# EAGLE design ECNG3020 Schematic (EAGLE 9.5.1)
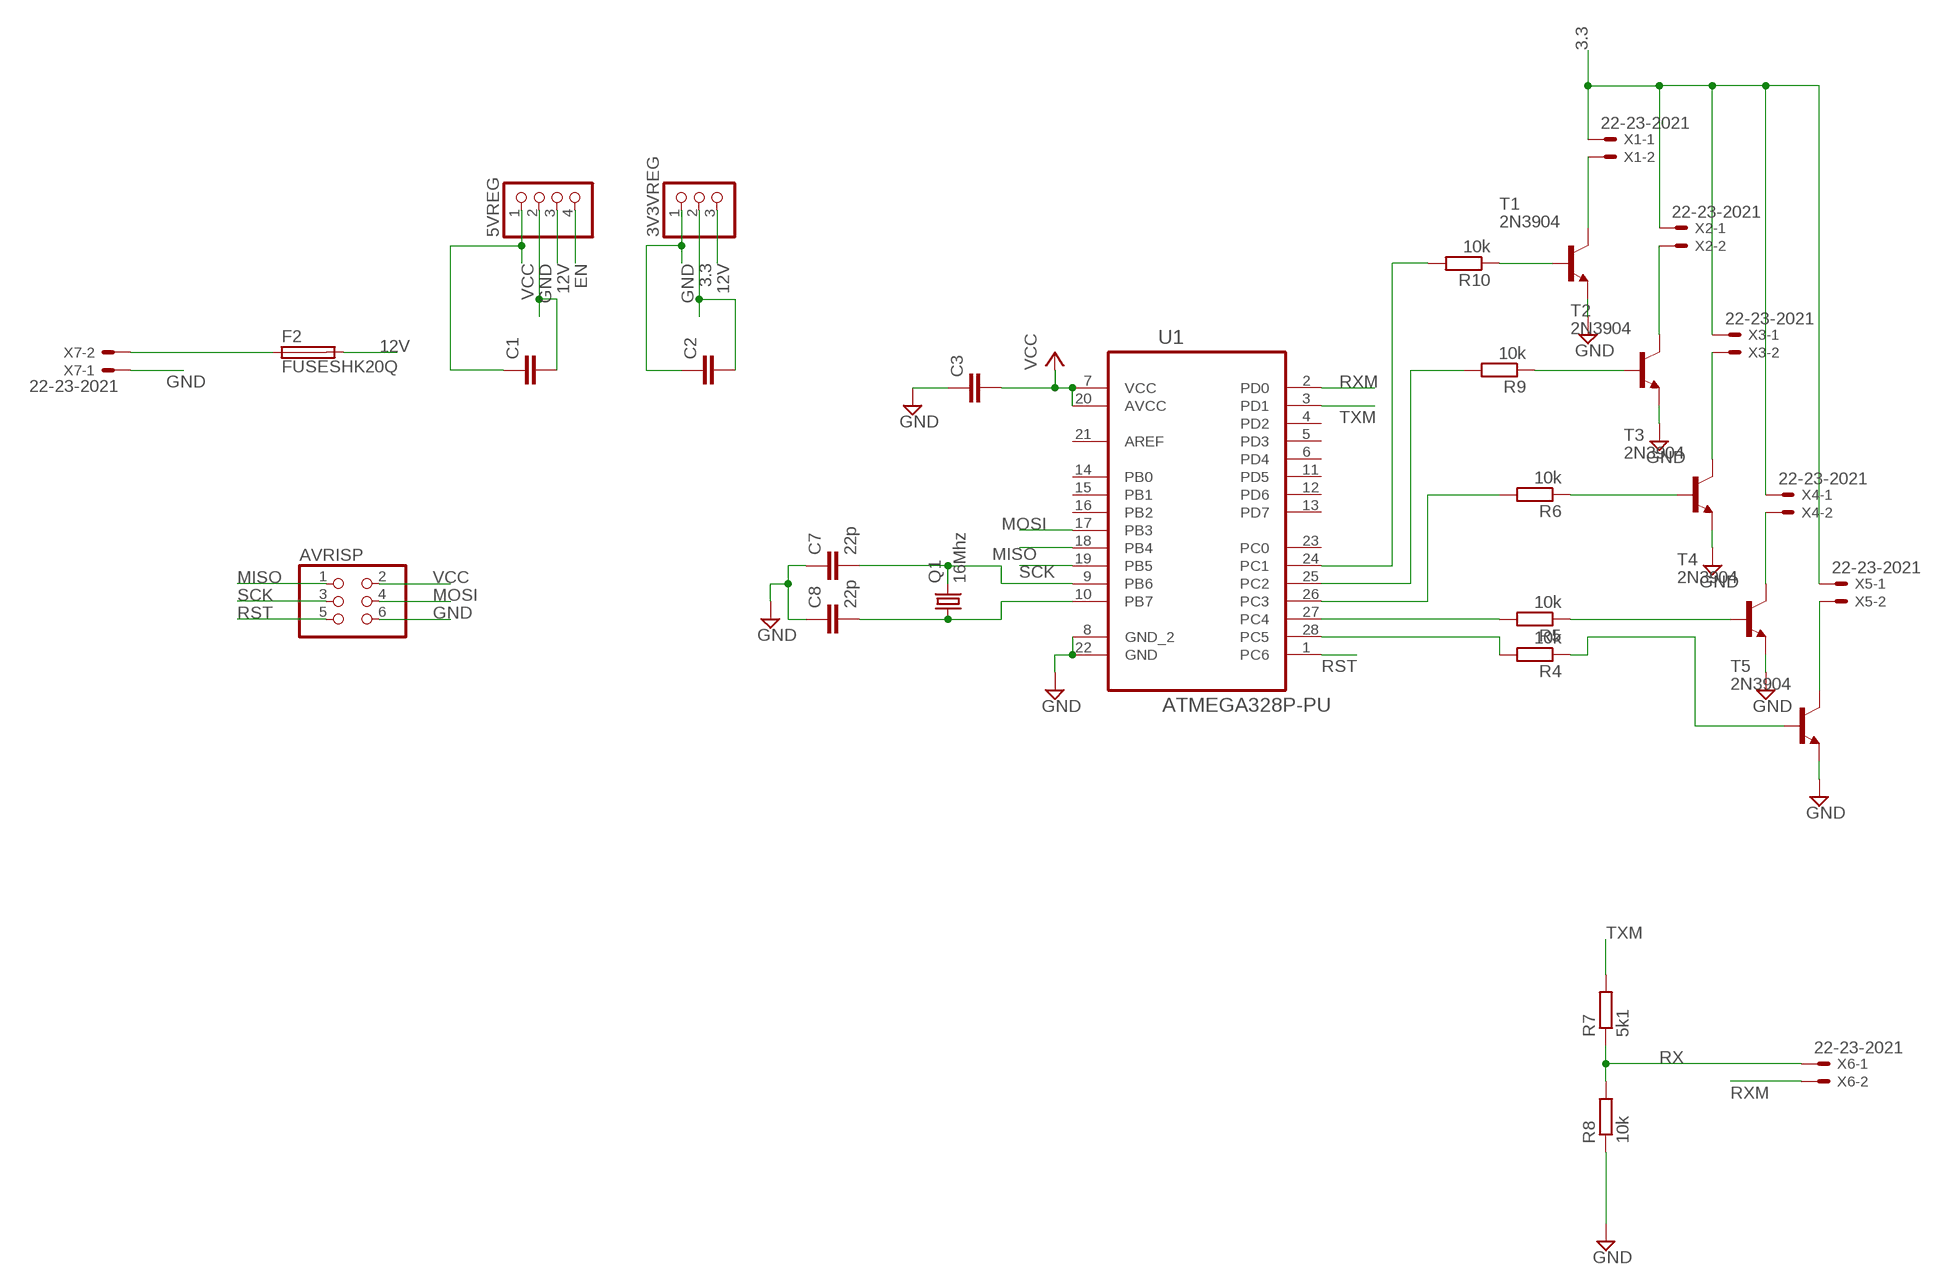
[diagram p0: schematic, sheet 1]

## Parts
3V3VREG  PINHD-1X3M  [1X03M]
5VREG  PINHD-1X4M  [1X04M]
AVRISP  PINHD-2X3  [2X03]
C1  C2,5-3  [C2.5-3]
C2  C2,5-3  [C2.5-3]
C3  C2,5-3  [C2.5-3]
C7  22p  C-EU050-024X044  [C050-024X044]
C8  22p  C-EU050-024X044  [C050-024X044]
F2  FUSESHK20Q  [SHK20Q]
Q1  16Mhz  CRYSTALHC49S  [HC49/S]
R4  10k  R-EU_0207/10  [0207/10]
R5  10k  R-EU_0207/10  [0207/10]
R6  10k  R-EU_0207/10  [0207/10]
R7  5k1  R-EU_0207/10  [0207/10]
R8  10k  R-EU_0207/10  [0207/10]
R9  10k  R-EU_0207/10  [0207/10]
R10  10k  R-EU_0207/10  [0207/10]
T1  2N3904  [TO92]
T2  2N3904  [TO92]
T3  2N3904  [TO92]
T4  2N3904  [TO92]
T5  2N3904  [TO92]
U1  ATMEGA328P-PU  [DIP254P762X457-28]
X1  22-23-2021  [22-23-2021]
X2  22-23-2021  [22-23-2021]
X3  22-23-2021  [22-23-2021]
X4  22-23-2021  [22-23-2021]
X5  22-23-2021  [22-23-2021]
X6  22-23-2021  [22-23-2021]
X7  22-23-2021  [22-23-2021]

## Nets
3.3: 3V3VREG.2 C2.2 X1.1 X2.1 X3.1 X4.1 X5.1
12V: 3V3VREG.3 5VREG.3 F2.2A
EN: 5VREG.4
GND: 3V3VREG.1 5VREG.2 AVRISP.6 C1.2 C2.1 C3.1 C7.1 C8.1 R8.1 T1.3(E) T2.3(E) T3.3(E) T4.3(E) T5.3(E) U1.8(GND_2) U1.22(GND) X7.1
MISO: AVRISP.1 U1.18(PB4)
MOSI: AVRISP.4 U1.17(PB3)
N$1: R10.2 U1.24(PC1)
N$2: R9.2 U1.25(PC2)
N$3: C7.2 Q1.2 U1.9(PB6)
N$4: R6.2 U1.26(PC3)
N$5: C8.2 Q1.1 U1.10(PB7)
N$6: R10.1 T1.2(B)
N$7: R4.1 T5.2(B)
N$8: T5.1(C) X5.2
N$9: T4.1(C) X4.2
N$10: T3.1(C) X3.2
N$11: T2.1(C) X2.2
N$12: T1.1(C) X1.2
N$13: F2.1A X7.2
N$14: R9.1 T2.2(B)
N$15: R6.1 T3.2(B)
N$16: R5.1 T4.2(B)
N$17: R5.2 U1.27(PC4)
N$18: R4.2 U1.28(PC5)
RST: AVRISP.5 U1.1(PC6)
RX: R7.1 R8.2 X6.1
RXM: U1.2(PD0) X6.2
SCK: AVRISP.3 U1.19(PB5)
TXM: R7.2 U1.3(PD1)
VCC: 5VREG.1 AVRISP.2 C1.1 C3.2 U1.7(VCC) U1.20(AVCC)
Unconnected: U1.4(PD2) U1.5(PD3) U1.6(PD4) U1.11(PD5) U1.12(PD6) U1.13(PD7) U1.14(PB0) U1.15(PB1) U1.16(PB2) U1.21(AREF) U1.23(PC0)

## Library data of the parts
3V3VREG = pinhead_2:PINHD-1X3: PIN HEADER
5VREG = pinhead_2:PINHD-1X4: PIN HEADER
AVRISP = pinhead_2:PINHD-2X3: PIN HEADER
C1-C3 = capacitor-wima:C: CAPACITOR naming: grid - package width
C7 C8 = rcl:C-EU: CAPACITOR, European symbol; SPICEPREFIX: C
F2 = fuse:FUSE: Fuse; OC_FARNELL: unknown; OC_NEWARK: unknown
Q1 = crystal:CRYSTAL: CRYSTAL; OC_FARNELL: 1667008; OC_NEWARK: unknown
R4-R10 = rcl:R-EU_: RESISTOR, European symbol; SPICEPREFIX: R
T1-T5 = transistor-neu-to92:2N3904: NPN TRANSISTOR
U1 = ATMEGA328P-PU:ATMEGA328P-PU: 8-bit Microcontroller with In-System Programmable Flash Buy Part <https://snapeda.com/parts/ATMEGA328P-PU/Microchip/view-part/?ref=eda>; AVAILABILITY: Good; DESCRIPTION: AVR AVR® ATmega Microcontroller IC 8-Bit 20MHz 32KB (16K x 16) FLASH 28-PDIP; DIGIKEY-PURCHASE-URL: https://snapeda.com/shop?store=DigiKey&id=2895131; MF: Microchip; MOUSER-PURCHASE-URL: https://snapeda.com/shop?store=Mouser&id=2895131; MP: ATMEGA328P-PU; PACKAGE: DIP-28 Generic; PRICE: None
X1-X7 = con-molex:22-23-2021: .100" (2.54mm) Center Header - 2 Pin; MF: MOLEX; MPN: 22-23-2021; OC_FARNELL: 1462926; OC_NEWARK: 25C3832

## Board
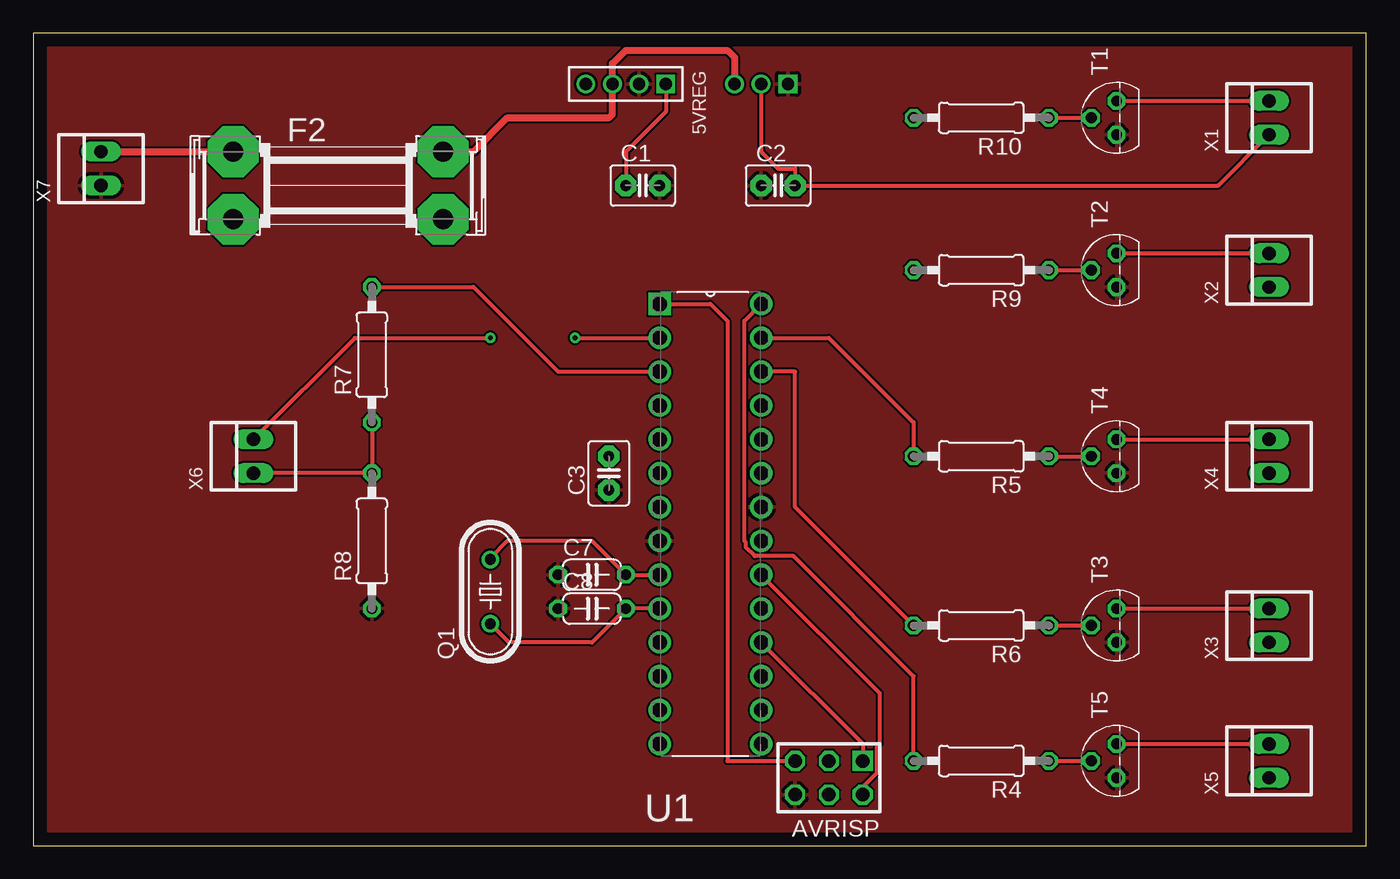
[diagram p1: board, top side]
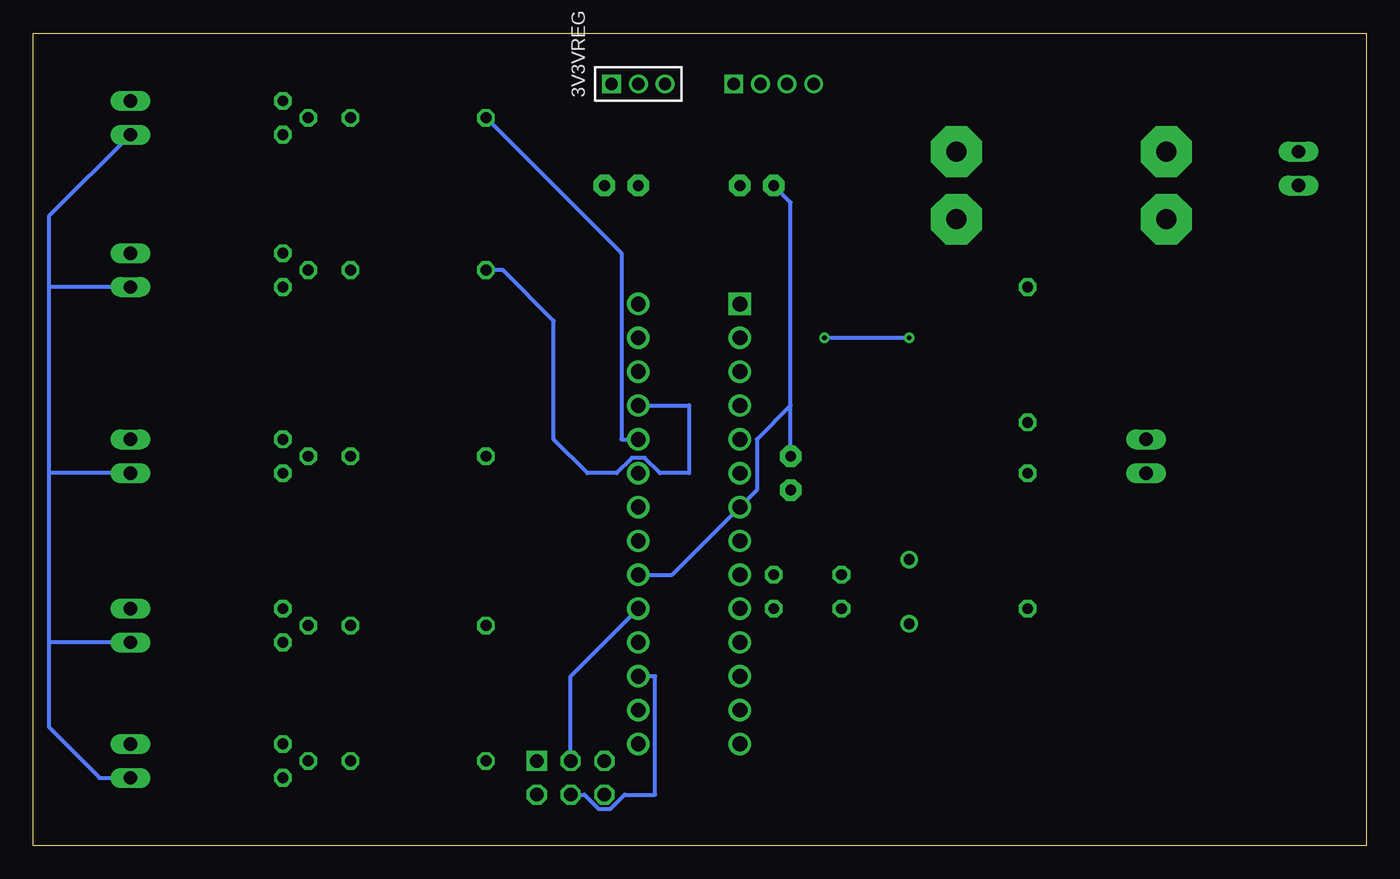
[diagram p2: board, bottom side, seen from below]

Size 100 x 60.95 mm. Coordinates in mm from the lower left corner, seen from the top.
Outline: 0,0 100,0 100,60.95 0,60.95 0,0
Copper layers (1*16): Top 0.035mm / dielectric 1.5mm / Bottom 0.035mm
Design rules "default": minimum track width 6mil, minimum drill 0.35mm, track to track 6mil, track to pad 6mil, pad to pad 6mil, via to via 6mil, smd to smd 6mil, copper to edge 40mil, drill to drill 6mil, minimum pad ring 10mil, minimum via ring 8mil, stop-mask expansion 4mil, vias tented up to drill 0mil, thermal gap 10mil

### Footprints (pad centres in the part's own frame; a part is rotated, then mirrored left to right if it is on the bottom)
1X03M = drill 0.914 square: 1 -2,0 | drill 0.914: 2 0,0; 3 2,0
1X04M = drill 0.914 square: 1 -3,0 | drill 0.914: 2 -1,0; 3 1,0; 4 3,0
2X03 = drill 1.016 square: 1 -2.54,-1.27 | drill 1.016 octagon: 2 -2.54,1.27; 3 0,-1.27; 4 0,1.27; 5 2.54,-1.27; 6 2.54,1.27
C2.5-3 = drill 0.813 pad 1.6 octagon: 1 -1.27,0; 2 1.27,0
C050-024X044 = drill 0.813 octagon: 1 -2.54,0; 2 2.54,0
SHK20Q = drill 1.5 pad 3.81 octagon: 1A -7.874,2.54; 1B -7.874,-2.54; 2A 7.874,2.54; 2B 7.874,-2.54
HC49/S = drill 0.813: 1 -2.413,0; 2 2.413,0
0207/10 = drill 0.813 octagon: 1 -5.08,0; 2 5.08,0
TO92 = drill 0.813 octagon: 1 1.27,0; 2 0,1.905; 3 -1.27,0
DIP254P762X457-28 = drill 1.118 square: 1 -7.62,33.02 | drill 1.118: 2 -7.62,30.48; 3 -7.62,27.94; 4 -7.62,25.4; 5 -7.62,22.86; 6 -7.62,20.32; 7 -7.62,17.78; 8 -7.62,15.24; 9 -7.62,12.7; 10 -7.62,10.16; 11 -7.62,7.62; 12 -7.62,5.08; 13 -7.62,2.54; 14 -7.62,0; 15 0,0; 16 0,2.54; 17 0,5.08; 18 0,7.62; 19 0,10.16; 20 0,12.7; 21 0,15.24; 22 0,17.78; 23 0,20.32; 24 0,22.86; 25 0,25.4; 26 0,27.94; 27 0,30.48; 28 0,33.02
22-23-2021 = drill 1 long: 1 -1.27,0; 2 1.27,0

### Placement (x,y rotation side)
3V3VREG  54.61,57.15 0 bottom
5VREG  44.45,57.15 180 top
AVRISP  59.69,5.08 180 top
C1  45.72,49.53 0 top
C2  55.88,49.53 0 top
C3  43.18,27.94 90 top
C7  41.91,20.32 0 top
C8  41.91,17.78 0 top
F2  22.86,49.53 0 top
Q1  34.29,19.05 90 top
R4  71.12,6.35 180 top
R5  71.12,29.21 180 top
R6  71.12,16.51 180 top
R7  25.4,36.83 90 top
R8  25.4,22.86 90 top
R9  71.12,43.18 180 top
R10  71.12,54.61 180 top
T1  81.28,54.61 90 top
T2  81.28,43.18 90 top
T3  81.28,16.51 90 top
T4  81.28,29.21 90 top
T5  81.28,6.35 90 top
U1  54.61,7.62 0 top
X1  92.71,54.61 90 top
X2  92.71,43.18 90 top
X3  92.71,16.51 90 top
X4  92.71,29.21 90 top
X5  92.71,6.35 90 top
X6  16.51,29.21 90 top
X7  5.08,50.8 90 top

### Tracks (layer width: path | path; a pad name or v marks a point on that pad's centre or on a via)
3.3
  Top 0.305: 3V3VREG.2 54.61,52.07 55.88,50.8 57.15,50.8 C2.2 88.9,49.53 X1.1
  Bottom 0.305: 98.83,41.91 98.83,47.22 X1.1 | 98.83,41.91 98.83,27.94 | 98.83,27.94 98.83,15.24 | 98.83,15.24 98.83,8.89 95.02,5.08 X5.1 | X3.1 98.83,15.24 | X4.1 98.83,27.94 | X2.1 98.83,41.91
12V
  Top 0.508: F2.2A 33.02,52.07 35.56,54.61 43.18,54.61 43.45,54.88 5VREG.3 43.45,58.68 44.45,59.68 52.07,59.68 52.61,59.14 3V3VREG.3
GND
  pour Top: 0,0 100.33,0 100.33,60.96 0,60.96
MISO
  Top 0.305: U1.18 62.23,7.62 AVRISP.1
MOSI
  Bottom 0.305: AVRISP.4 58.66,3.81 57.59,2.74 56.71,2.74 55.64,3.81 53.34,3.81 53.34,12.7 U1.17
N$1
  Bottom 0.305: R10.2 55.88,44.45 55.88,30.48 U1.24
N$2
  Bottom 0.305: U1.25 50.8,33.02 50.8,27.94 52.99,27.94 54.14,29.08 55.08,29.08 56.23,27.94 58.42,27.94 60.96,30.48 60.96,39.37 64.77,43.18 R9.2
N$3
  Top 0.305: U1.9 C7.2 41.91,22.86 35.56,22.86 34.29,21.59 Q1.2
N$4
  Top 0.305: R6.2 57.15,25.4 57.15,35.56 U1.26
N$5
  Top 0.305: U1.10 C8.2 41.91,15.24 35.69,15.24 Q1.1
N$6
  Top 0.305: R10.1 T1.2
N$7
  Top 0.305: R4.1 T5.2
N$8
  Top 0.305: T5.1 X5.2
N$9
  Top 0.305: T4.1 X4.2
N$10
  Top 0.305: T3.1 X3.2
N$11
  Top 0.305: T2.1 X2.2
N$12
  Top 0.305: T1.1 X1.2
N$13
  Top 0.508: X7.2 F2.1A
N$14
  Top 0.305: R9.1 T2.2
N$15
  Top 0.305: R6.1 T3.2
N$16
  Top 0.305: R5.1 T4.2
N$17
  Top 0.305: U1.27 59.69,38.1 66.04,31.75 R5.2
N$18
  Top 0.305: R4.2 66.04,12.7 57.02,21.72 54.14,21.72 53.47,22.39 53.47,22.73 53.34,22.86 53.34,39.37 U1.28
RST
  Top 0.305: U1.1 50.8,40.64 52.07,39.37 52.07,6.35 AVRISP.5
RX
  Top 0.305: R7.1 R8.2 X6.1
RXM  (via drill 0.35)
  Top 0.305: X6.2 24.13,38.1 v34.29,38.1 | v40.64,38.1 U1.2
  Bottom 0.305: v34.29,38.1 v40.64,38.1
SCK
  Bottom 0.305: U1.19 59.69,12.7 AVRISP.3
TXM
  Top 0.305: R7.2 33.02,41.91 39.37,35.56 U1.3
VCC
  Top 0.305: 5VREG.1 47.45,55.07 44.45,52.07 C1.1 | AVRISP.2 62.23,4.39 63.3,5.46 63.3,7.42 63.5,7.62 63.5,11.43 U1.20
  Bottom 0.305: C3.2 43.18,33.02 | 43.18,33.02 43.18,48.26 C1.1 | 43.18,33.02 45.72,30.48 45.72,26.67 U1.7 52.07,20.32 U1.20